# EAGLE schematic IR remote 2.1 (EAGLE 7.3.0)
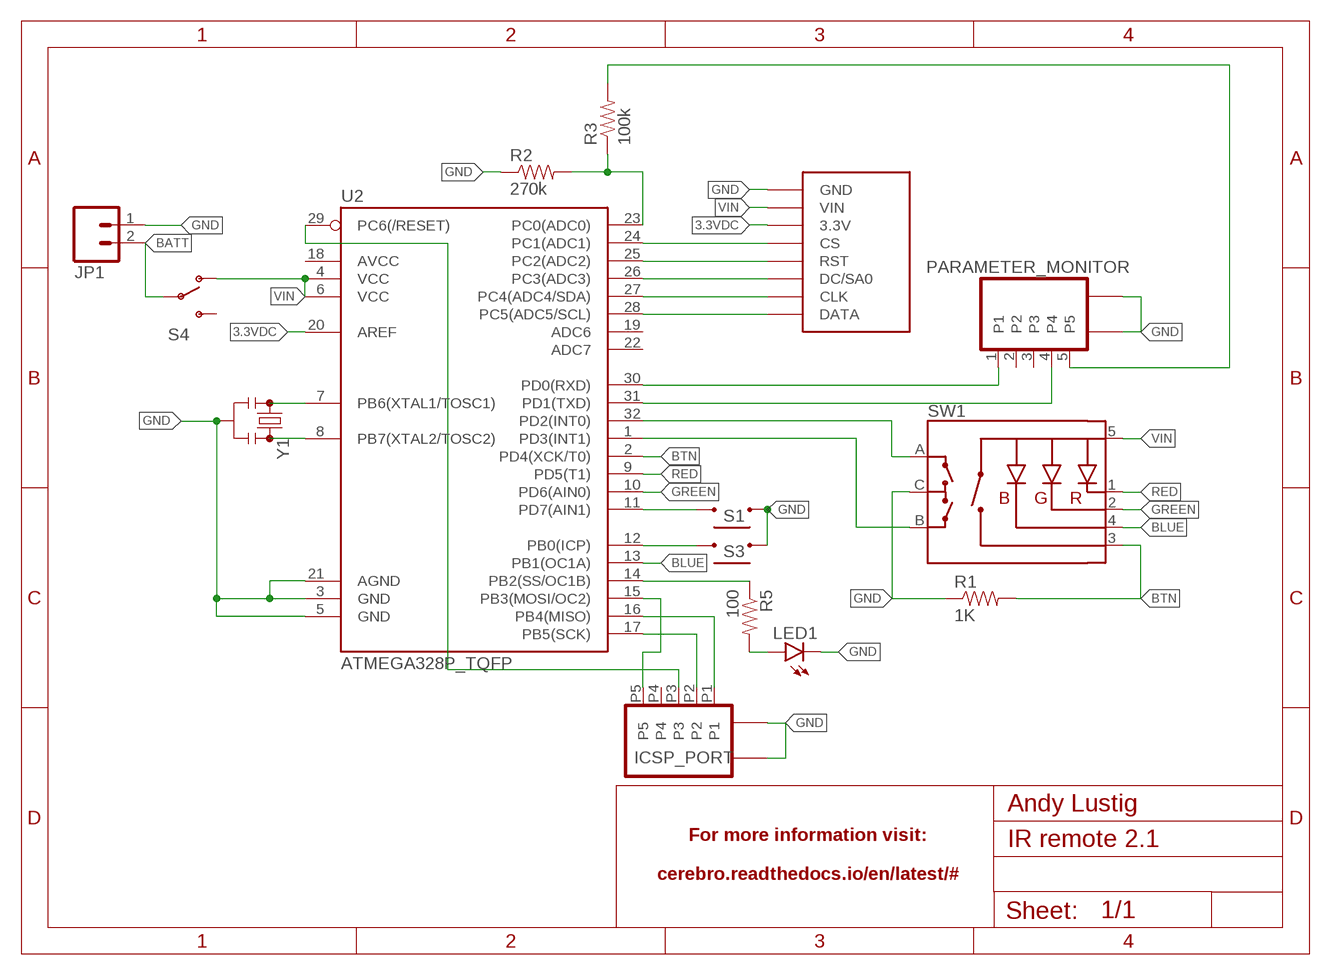
[diagram p0: schematic, sheet 1]

## Parts
ICSP_PORT  USB_SOCKET_MICRO_VERTREINFORCED  [USB_HORZ_REINFORCED_MICRO]
JP1  M02JST-PTH-2  [JST-2-PTH]
LED1  LED5MM-KIT  [LED5MM-KIT]
PARAMETER_MONITOR  USB_MICROB_PLUG-PTH2  [MICRO-B-TH]
R1  1K  RESISTORPTH-1/4W-VERT  [AXIAL-0.1]
R2  270k  RESISTORPTH-1/4W-VERT  [AXIAL-0.1]
R3  100k  RESISTORPTH-1/4W-VERT  [AXIAL-0.1]
R5  100  RESISTORPTH-1/4W-VERT  [AXIAL-0.1]
S1  SWITCH-MOMENTARY-2-CLOSED  [TACTILE-PTH-12MM]
S3  SWITCH-MOMENTARY-2-CLOSED  [TACTILE-PTH-12MM]
S4  SWITCH-SPDT  [TOGGLE]
SW1  ENCODER_RGB_CAKIT  [ENCODER_LED_3_KIT]
U2  ATMEGA328P_TQFP  [TQFP32-08]
U$1  OLED_DISPLAY  [OLED_DISPLAY]
Y1  RESONATORPTH  [RESONATOR-PTH]

## Nets
3.3VDC: U2.20(AREF) U$1.3V3(3.3V)
BATT: JP1.2 S4.P$2(P)
BLUE: SW1.4(-B) U2.13(PB1(OC1A))
BTN: R1.P$2 SW1.3(SW) U2.2(PD4(XCK/T0))
GND: ICSP_PORT.G1 ICSP_PORT.G2 ICSP_PORT.P$1 ICSP_PORT.P$2 JP1.1 LED1.K(C) PARAMETER_MONITOR.P$1 PARAMETER_MONITOR.P$2 R1.P$1 R2.P$1 S1.3 S3.3 SW1.C U2.3(GND) U2.5(GND) U2.21(AGND) U$1.GND Y1.2
GREEN: SW1.2(-G) U2.10(PD6(AIN0))
LED: R5.P$1 U2.14(PB2(SS/OC1B))
N$1: PARAMETER_MONITOR.4 U2.31(PD1(TXD))
N$2: U2.28(PC5(ADC5/SCL)) U$1.DATA
N$3: S1.1 U2.11(PD7(AIN1))
N$4: U2.27(PC4(ADC4/SDA)) U$1.CLK
N$5: U2.7(PB6(XTAL1/TOSC1)) Y1.1
N$6: U2.8(PB7(XTAL2/TOSC2)) Y1.3
N$7: U2.26(PC3(ADC3)) U$1.DC(DC/SA0)
N$8: U2.25(PC2(ADC2)) U$1.RST
N$9: U2.24(PC1(ADC1)) U$1.CS
N$10: SW1.B U2.1(PD3(INT1))
N$11: SW1.A U2.32(PD2(INT0))
N$12: PARAMETER_MONITOR.5 R3.P$2
N$13: LED1.A R5.P$2
N$14: PARAMETER_MONITOR.1 U2.30(PD0(RXD))
N$16: R2.P$2 R3.P$1 U2.23(PC0(ADC0))
N$17: ICSP_PORT.P1 U2.16(PB4(MISO))
N$18: ICSP_PORT.P2 U2.17(PB5(SCK))
N$19: ICSP_PORT.P3 U2.29(PC6(/RESET))
N$20: ICSP_PORT.P5 U2.15(PB3(MOSI/OC2))
N$21: S3.1 U2.12(PB0(ICP))
RED: SW1.1(-R) U2.9(PD5(T1))
VIN: S4.P$1(O) SW1.5(+) U2.4(VCC) U2.6(VCC) U$1.VIN
Unconnected: ICSP_PORT.P4 PARAMETER_MONITOR.2 PARAMETER_MONITOR.3 S4.P$3(S) U2.18(AVCC) U2.19(ADC6) U2.22(ADC7)

## Library data of the parts
ICSP_PORT = Andy-library:USB_SOCKET_MICRO_VERT: horizontal socket. Digikey 609-4616-1-ND
JP1 = SparkFun-Connectors:M02: Standard 2-pin 0.1" header. Use with - straight break away headers ( PRT-00116) - right angle break away headers (PRT-00553) - swiss pins (PRT-00743) - machine pins (PRT-00117) - female headers (PRT-00115) Molex polarized connector foot print use with: PRT-08233 with associated crimp pins and housings. 2.54_SCREWTERM for use with PRT-10571. 3.5mm Screw Terminal footprints for PRT-08084 5mm Screw Terminal footprints for use with PRT-08432; PROD_ID: CONN-09863; SKU: PRT-09914
LED1 = SparkFun-LED:LED: LEDs Standard schematic elements and footprints for 5mm, 3mm, 1206, and 0603 sized LEDs. 5mm - Spark Fun Electronics SKU : COM-00529 (and others)
PARAMETER_MONITOR = Andy-library:USB_MICROB_PLUG: USB Micro-B connectors Some male, some female. Watch your step!
R1-R3 R5 = SparkFun-Resistors:RESISTOR: Resistor Basic schematic elements and footprints for 0603, 1206, and PTH resistors.
S1 S3 = Andy-library:SWITCH-MOMENTARY-2-CLOSED: Closed Switch for tutorial schematics. Not intended for PCB design. Maps to 12mm tact switch, only because eagle won't place a part with no package defined. The ordinary SWITCH-MOMENTARY-2 is likely to be more useful for regular schematics.
S4 = Andy-library:SWITCH-SPDT: SPDT Switch slide switch AYZ0102
SW1 = SparkFun-Electromechanical:ENCODER_RGB_CA: Illuminated Rotary Encoder w/ RGB LED and select switch EC12PLRGBSDVBF-D: http://top-up.so-buy.com/front/bin/ptdetail.phtml?Part=EC12PLRGBSDVBF-D
U2 = SparkFun-DigitalIC:ATMEGA328P_TQFP; PROD_ID: IC-09069
U$1 = Andy-library:OLED_DISPLAY
Y1 = SparkFun-FreqCtrl:RESONATOR: Resonator Small SMD resonator. Used, eg, on the Arduino Pro/ Pro Mini boards. 8MHz- XTAL-08895 16MHz- XTAL-08900

## Net classes
0 default: clearance 0.254 mm